# Altium schematic sheet 0074_S0IX_REQ_ACK_OPTIO.SchDoc
size 848 x 558 mm
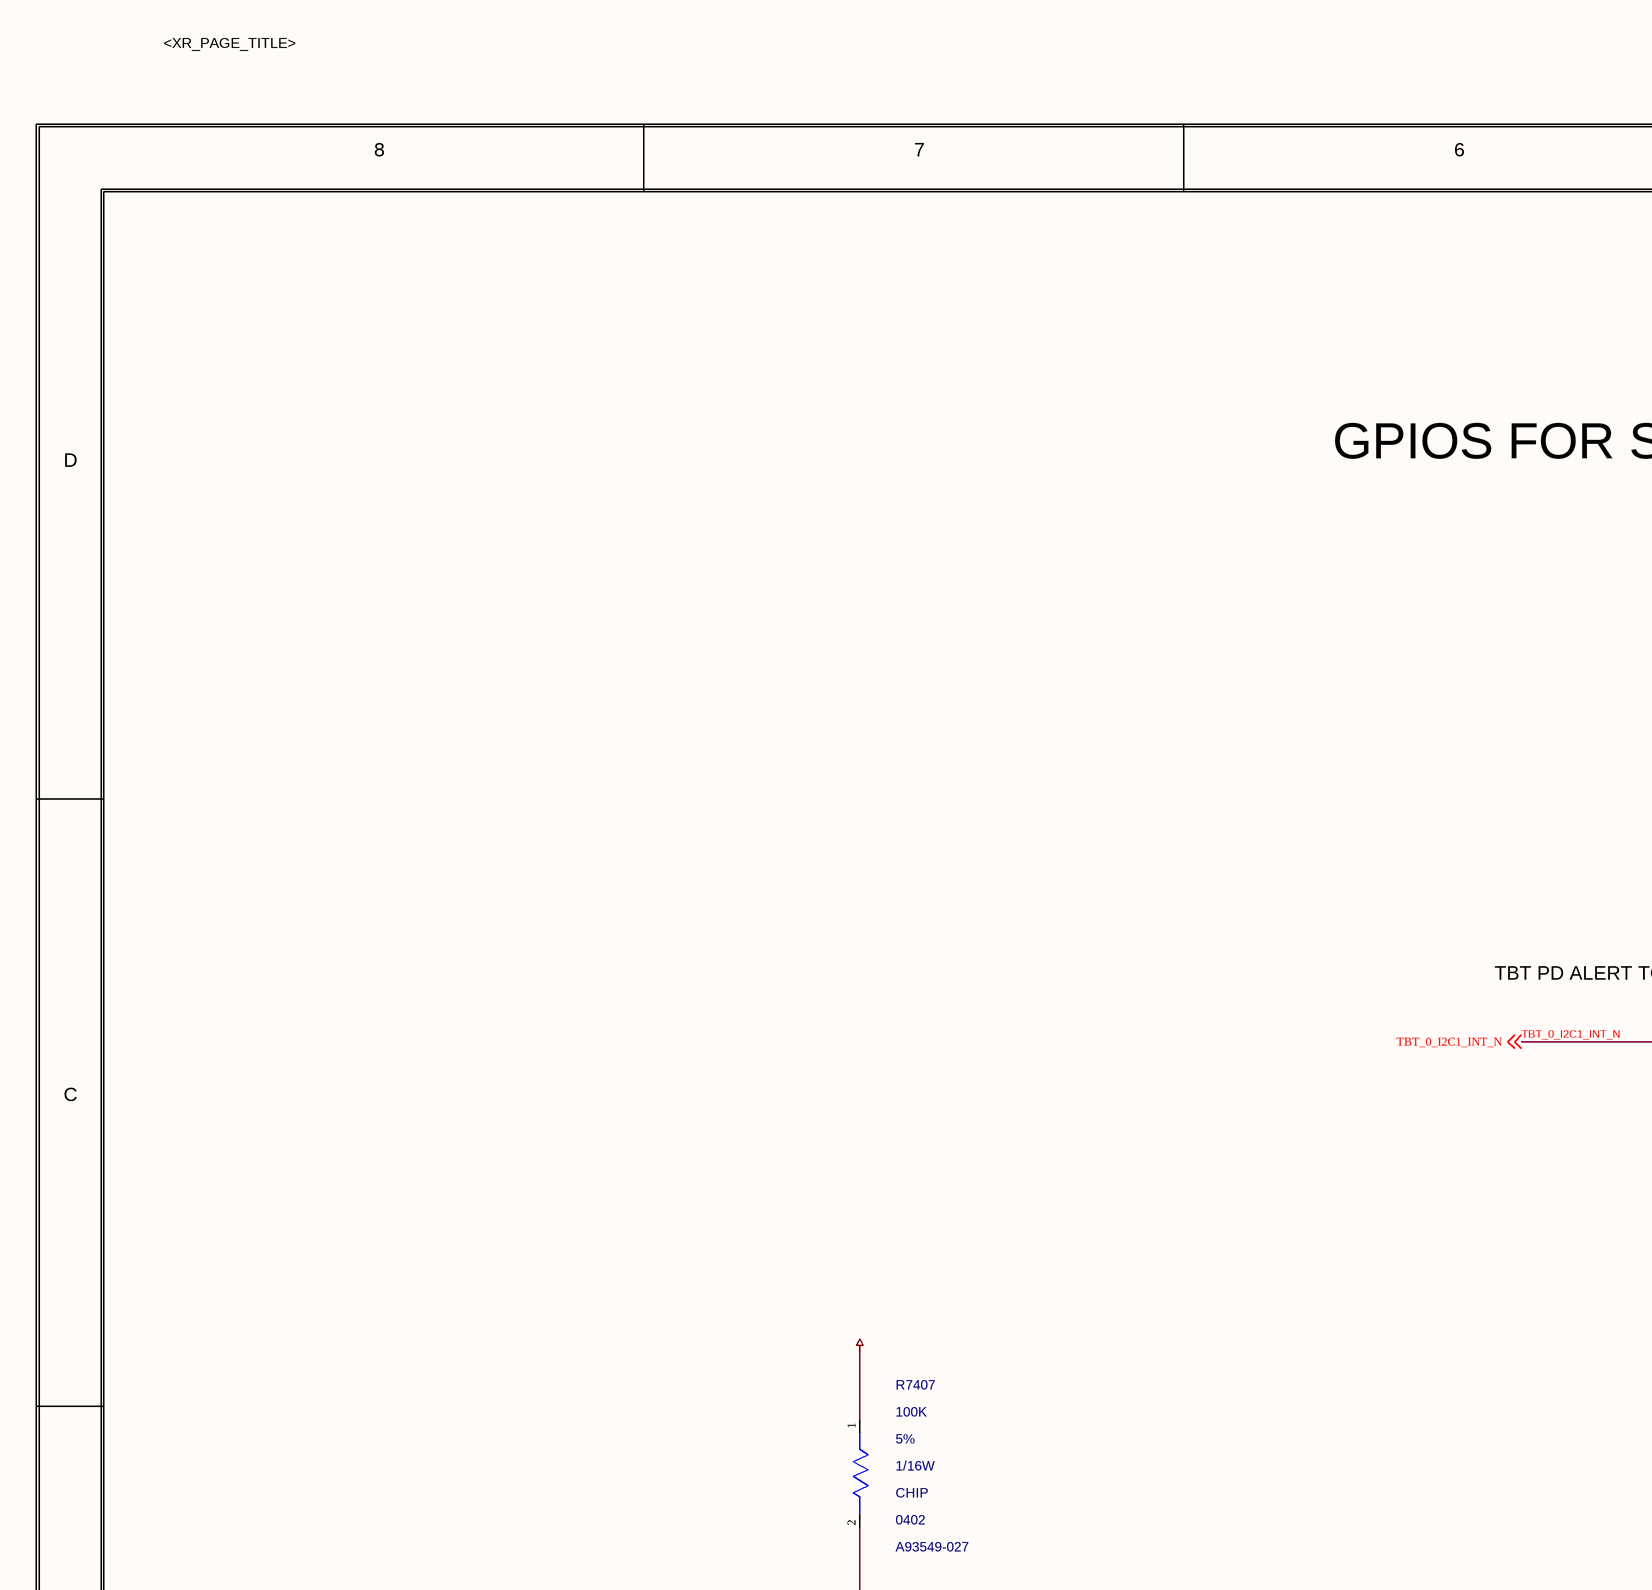
[diagram p0: 0074_S0IX_REQ_ACK_OPTIO.SchDoc, top left]
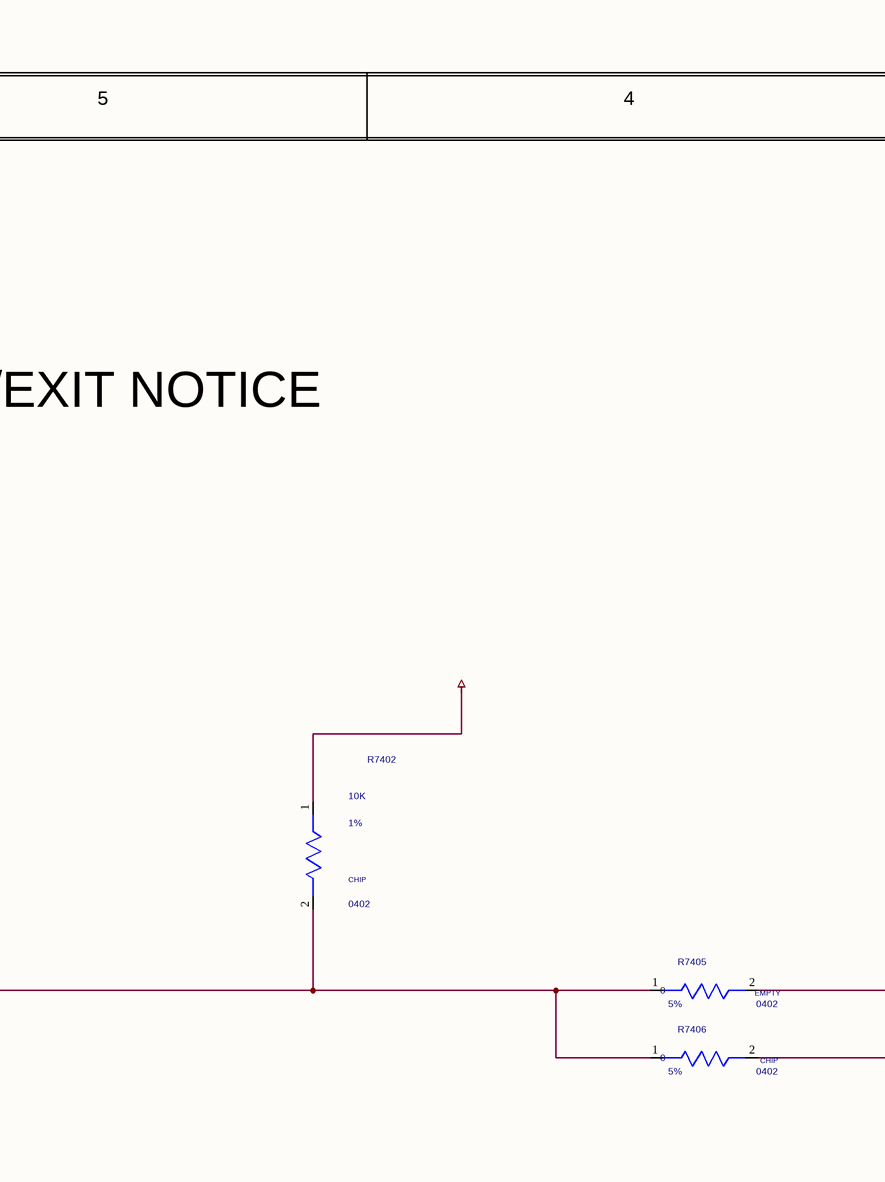
[diagram p1: 0074_S0IX_REQ_ACK_OPTIO.SchDoc, top middle]
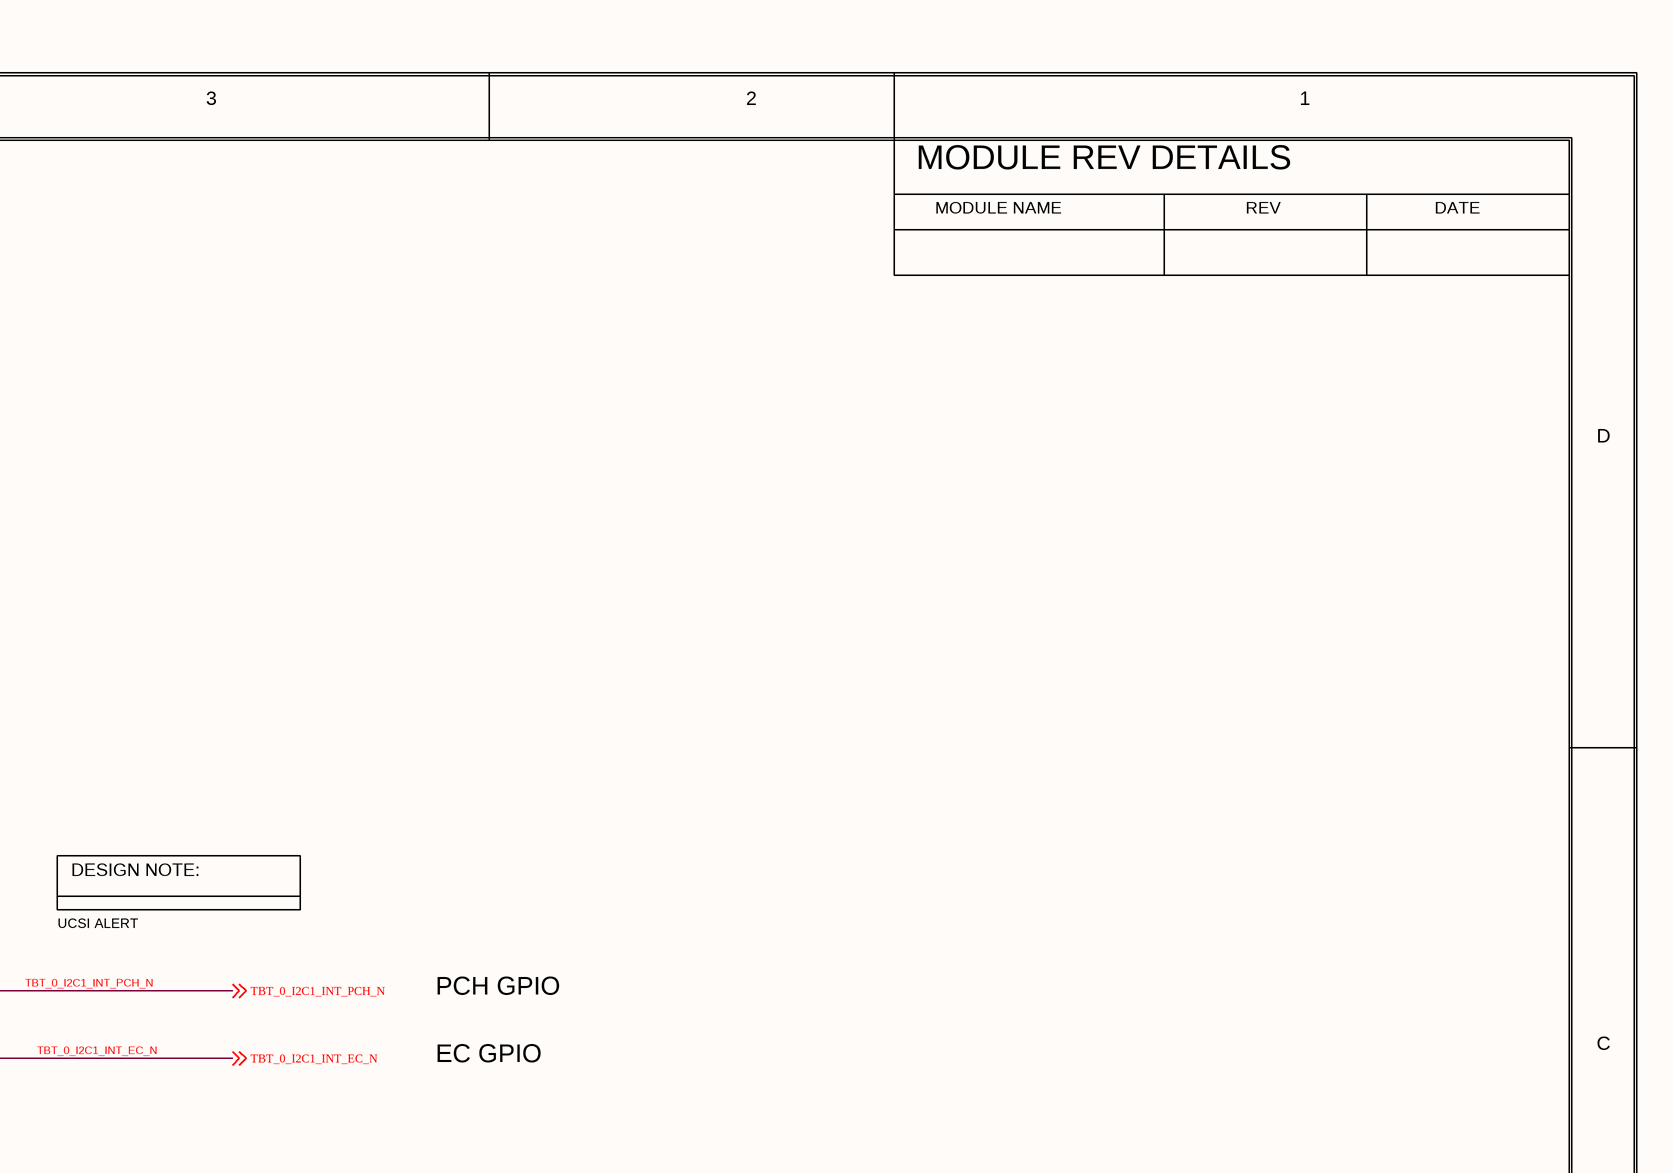
[diagram p2: 0074_S0IX_REQ_ACK_OPTIO.SchDoc, top right]
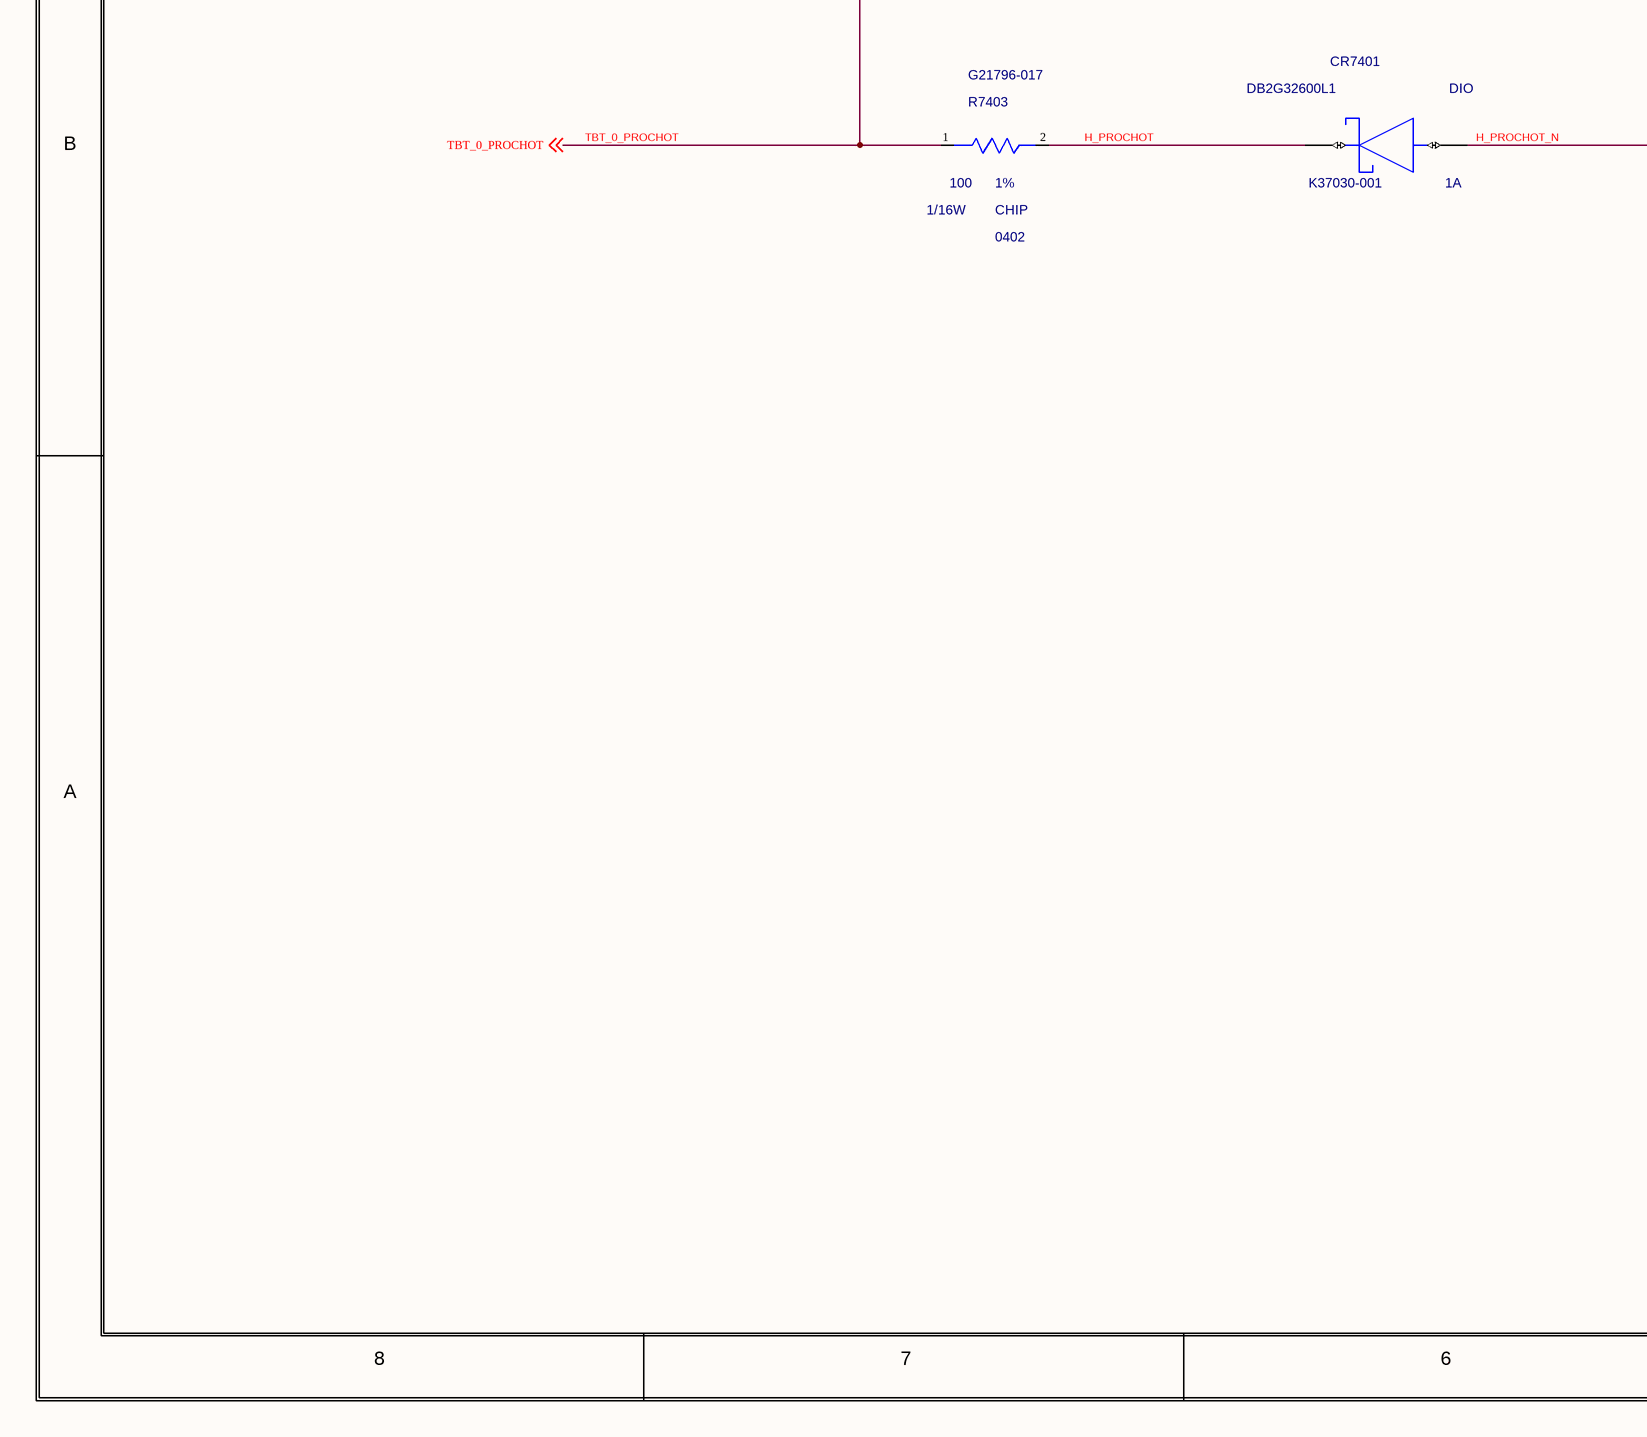
[diagram p3: 0074_S0IX_REQ_ACK_OPTIO.SchDoc, bottom left]
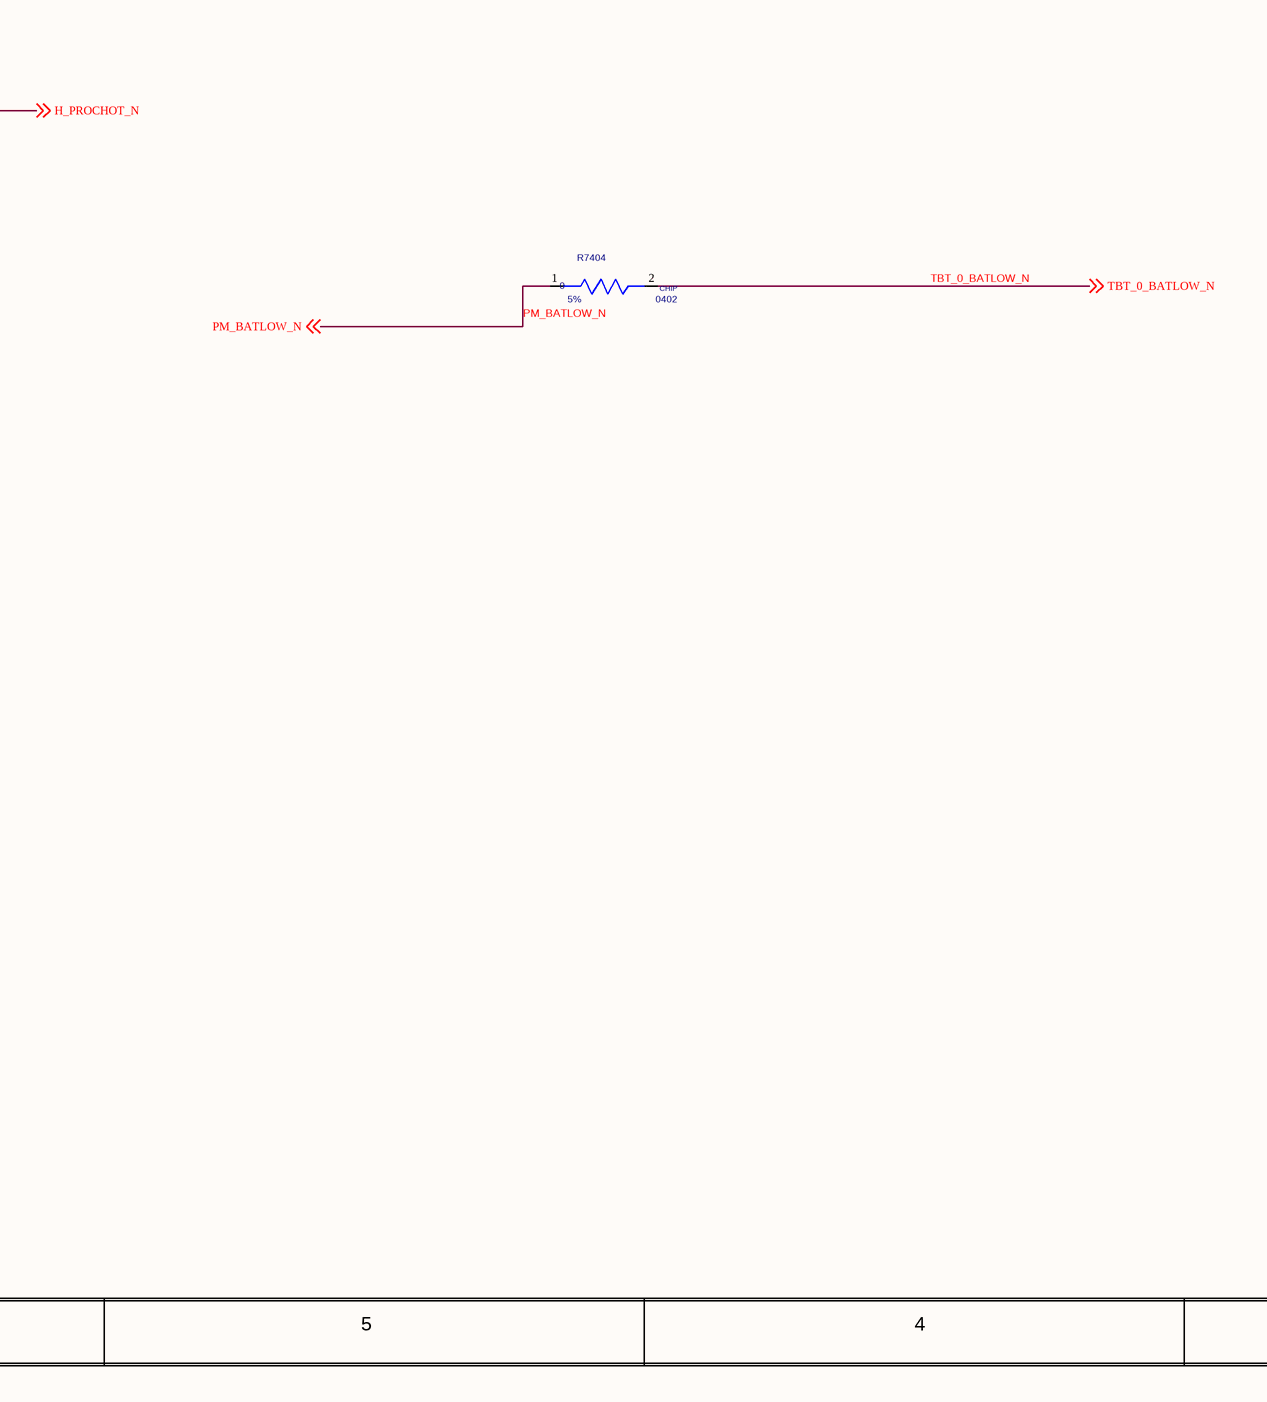
[diagram p4: 0074_S0IX_REQ_ACK_OPTIO.SchDoc, bottom middle]
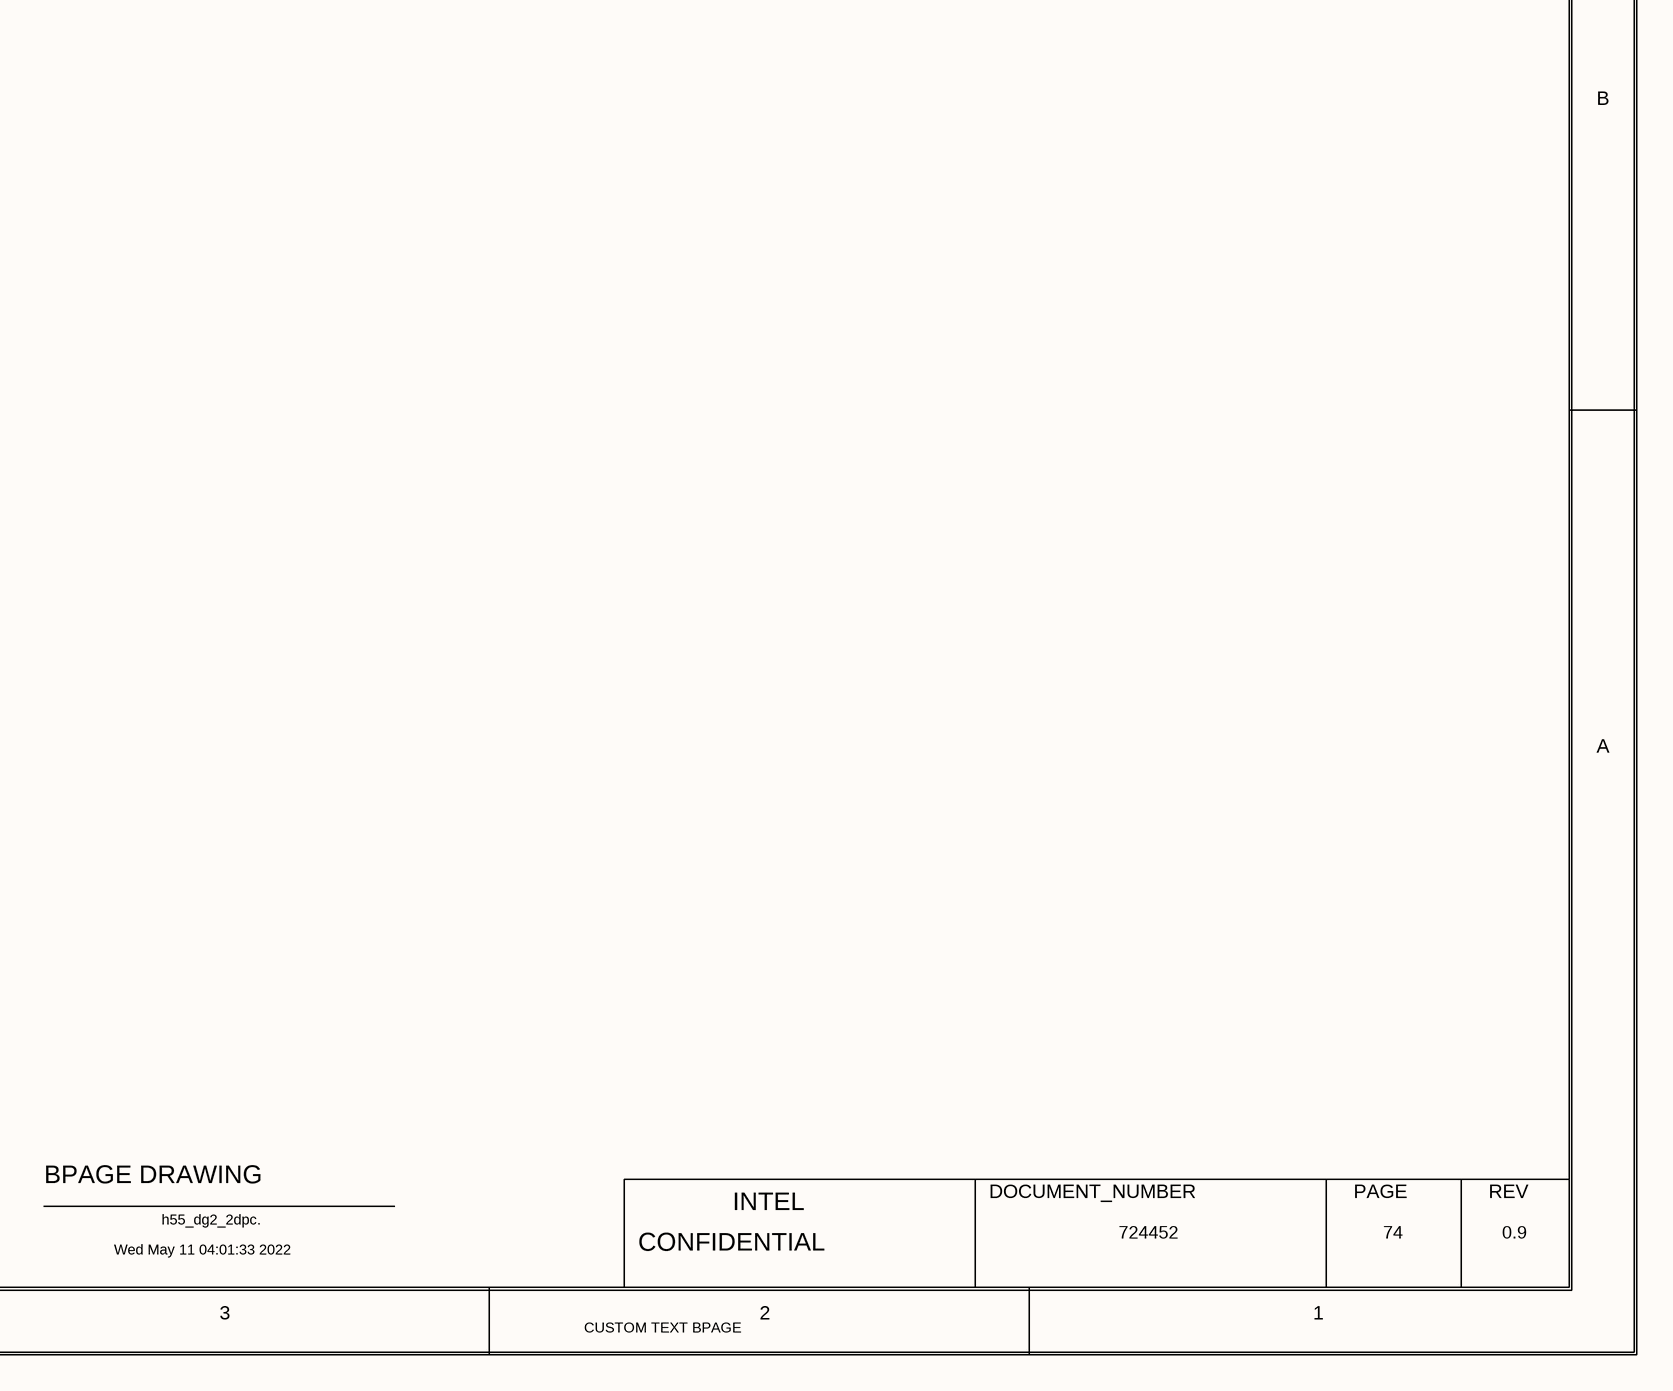
[diagram p5: 0074_S0IX_REQ_ACK_OPTIO.SchDoc, bottom right]

## Parts
CR7401  DB2G32600L1  CURRENT: 1A  MATERIAL: DIO  PART_NUMBER: K37030-001  [TK0_SCR0402_1050X650_MA]
R7402  10K  MATERIAL: CHIP  PACK_TYPE: 0402  TOLERANCE: 1%  [SMR0402IA]
R7403  100  MATERIAL: CHIP  PACK_TYPE: 0402  PART_NUMBER: G21796-017  TOLERANCE: 1%  WATTAGE: 1/16W  [SMR0402IA]
R7404  0  MATERIAL: CHIP  PACK_TYPE: 0402  TOLERANCE: 5%  [SMR0402IA]
R7405  0  MATERIAL: EMPTY  PACK_TYPE: 0402  TOLERANCE: 5%  [SMR0402IA]
R7406  0  MATERIAL: CHIP  PACK_TYPE: 0402  TOLERANCE: 5%  [SMR0402IA]
R7407  100K  MATERIAL: CHIP  PACK_TYPE: 0402  PART_NUMBER: A93549-027  TOLERANCE: 5%  WATTAGE: 1/16W  [SMR0402IA]

## Nets
+V3P3A: R7407.1(A)
+V3P3A_KBC: R7402.1(A)
H_PROCHOT: CR7401.1(CATHODE) R7403.2(B)
H_PROCHOT_N: CR7401.2(ANODE) ; off-sheet H_PROCHOT_N
PM_BATLOW_N: R7404.1(A) ; off-sheet PM_BATLOW_N
TBT_0_BATLOW_N: R7404.2(B) ; off-sheet TBT_0_BATLOW_N
TBT_0_I2C1_INT_EC_N: R7406.2(B) ; off-sheet TBT_0_I2C1_INT_EC_N
TBT_0_I2C1_INT_N: R7402.2(B) R7405.1(A) R7406.1(A) ; off-sheet TBT_0_I2C1_INT_N
TBT_0_I2C1_INT_PCH_N: R7405.2(B) ; off-sheet TBT_0_I2C1_INT_PCH_N
TBT_0_PROCHOT: R7403.1(A) R7407.2(B) ; off-sheet TBT_0_PROCHOT

## Notes on the sheet
- <XR_PAGE_TITLE>
- 8
- 7
- 6
- 5
- 4
- 3
- 2
- 1
- MODULE REV DETAILS
- MODULE NAME
- REV
- DATE
- D
- GPIOS FOR SX ENTRY/EXIT NOTICE
- DESIGN NOTE:
- TBT PD ALERT TO EC
- UCSI ALERT
- PCH GPIO
- C
- EC GPIO
- B
- A
- BPAGE DRAWING
- INTEL
- DOCUMENT_NUMBER
- PAGE
- Wed May 11 04:01:33 2022
- h55_dg2_2dpc.
- CONFIDENTIAL
- 724452
- 74
- 0.9
- CUSTOM TEXT BPAGE

## Library data of the parts
CR7401 = DIODE_SCHOTTKY_2: CDS_PHYS_PART_NAME: DIODE_SCHOTTKY_2_SM-K37030-001,DIO,DB2G32600L1,1A,TK0,GENERIC; BOM_USE: STUFF; CDS_LMAN_SYM_OUTLINE: -50,100,50,-100; FP_TECH: TK0; IP: GENERIC; PACK_TYPE: SM; ROOM: NONE; OriginalSymbolOrigin: (-75,50); XY: (-5625,2200); VER: 1; ROT: 2; PHYS_PAGE: 74; LOCATION: CR7401; DRAWING: @RVP1_ADL_SB_ADP_S_DDR5_SODIMM_2DPC_LIB.H55_DG2_2DPC(SCH_1):PAGE74; CDS_LIB: local; VARIANT: ?; PCB Footprint: TK0_SCR0402_1050X650_MA; CHIPS_PART_NAME: DIODE_SCHOTTKY_2; CDS_PART_NAME: DIODE_SCHOTTKY_2_SM-K37030-001,DIO,DB2G32600L1,1A,TK0,GENERIC; CDS_LOCATION: CR7401
R7402 = RES: PART_NUMBER: A93548-034; CDS_PHYS_PART_NAME: RES_0402-A93548-034,CHIP,10K,1%,1/16W,LPDB,GENERIC; WATTAGE: 1/16W; OriginalSymbolOrigin: (-25,75); XY: (-4100,3675); VER: 2; ROT: 0; PHYS_PAGE: 74; LOCATION: R7402; IP: GENERIC; FP_TECH: LPDB; DRAWING: @RVP1_ADL_SB_ADP_S_DDR5_SODIMM_2DPC_LIB.H55_DG2_2DPC(SCH_1):PAGE74; CDS_LIB: discrete; PCB Footprint: SMR0402IA; SEC_TYPE: 0402; CHIPS_PART_NAME: RES; CDS_PART_NAME: RES_0402-A93548-034,CHIP,10K,1%,1/16W,LPDB,GENERIC; CDS_LOCATION: R7402; ASI_MODEL: A93548-034
R7403 = RES#1: CHIPS_PART_NAME: RES; CDS_PHYS_PART_NAME: RES_0402-G21796-017,CHIP,100,1%,1/16W,LPDB,GENERIC; OriginalSymbolOrigin: (-75,25); XY: (-6350,2200); VER: 1; ROT: 0; PHYS_PAGE: 74; LOCATION: R7403; IP: GENERIC; FP_TECH: LPDB; DRAWING: @RVP1_ADL_SB_ADP_S_DDR5_SODIMM_2DPC_LIB.H55_DG2_2DPC(SCH_1):PAGE74; CDS_LIB: discrete; PCB Footprint: SMR0402IA; CDS_PART_NAME: RES_0402-G21796-017,CHIP,100,1%,1/16W,LPDB,GENERIC; CDS_LOCATION: R7403
R7404 = RES#1: PART_NUMBER: A93549-001; CHIPS_PART_NAME: RES; CDS_PHYS_PART_NAME: RES_0402-A93549-001,CHIP,0,5%,1/16W,LPDB,GENERIC; WATTAGE: 1/16W; OriginalSymbolOrigin: (-75,25); XY: (-4075,1875); VER: 1; PHYS_PAGE: 74; LOCATION: R7404; IP: GENERIC; FP_TECH: LPDB; DRAWING: @RVP1_ADL_SB_ADP_S_DDR5_SODIMM_2DPC_LIB.H55_DG2_2DPC(SCH_1):PAGE74; CDS_LIB: discrete; PCB Footprint: SMR0402IA; ROT: 0; CDS_PART_NAME: RES_0402-A93549-001,CHIP,0,5%,1/16W,LPDB,GENERIC; CDS_LOCATION: R7404; ASI_MODEL: A93549-001
R7405 = RES#1: PART_NUMBER: A93549-001; CHIPS_PART_NAME: RES; CDS_PHYS_PART_NAME: RES_0402-A93549-001,EMPTY,0,5%,1/16W,LPDB,GENERIC; WATTAGE: 1/16W; OriginalSymbolOrigin: (-75,25); XY: (-3375,3425); VER: 1; PHYS_PAGE: 74; LOCATION: R7405; IP: GENERIC; FP_TECH: LPDB; DRAWING: @RVP1_ADL_SB_ADP_S_DDR5_SODIMM_2DPC_LIB.H55_DG2_2DPC(SCH_1):PAGE74; CDS_LIB: discrete; PCB Footprint: SMR0402IA; ROT: 0; CDS_PART_NAME: RES_0402-A93549-001,EMPTY,0,5%,1/16W,LPDB,GENERIC; CDS_LOCATION: R7405; ASI_MODEL: A93549-001
R7406 = RES#1: PART_NUMBER: A93549-001; CHIPS_PART_NAME: RES; CDS_PHYS_PART_NAME: RES_0402-A93549-001,CHIP,0,5%,1/16W,LPDB,GENERIC; WATTAGE: 1/16W; OriginalSymbolOrigin: (-75,25); XY: (-3375,3300); VER: 1; PHYS_PAGE: 74; LOCATION: R7406; IP: GENERIC; FP_TECH: LPDB; DRAWING: @RVP1_ADL_SB_ADP_S_DDR5_SODIMM_2DPC_LIB.H55_DG2_2DPC(SCH_1):PAGE74; CDS_LIB: discrete; PCB Footprint: SMR0402IA; ROT: 0; CDS_PART_NAME: RES_0402-A93549-001,CHIP,0,5%,1/16W,LPDB,GENERIC; CDS_LOCATION: R7406; ASI_MODEL: A93549-001
R7407 = RES: CDS_PHYS_PART_NAME: RES_0402-A93549-027,CHIP,100K,5%,1/16W,LPDB,GENERIC; OriginalSymbolOrigin: (-25,75); XY: (-6600,2625); VER: 2; ROT: 0; PHYS_PAGE: 74; LOCATION: R7407; IP: GENERIC; FP_TECH: LPDB; DRAWING: @RVP1_ADL_SB_ADP_S_DDR5_SODIMM_2DPC_LIB.H55_DG2_2DPC(SCH_1):PAGE74; CDS_LIB: discrete; PCB Footprint: SMR0402IA; CHIPS_PART_NAME: RES; CDS_PART_NAME: RES_0402-A93549-027,CHIP,100K,5%,1/16W,LPDB,GENERIC; CDS_LOCATION: R7407